# Altium project BLDC_MOTOR_DRIVER.PrjPcb (part 1 of 3)
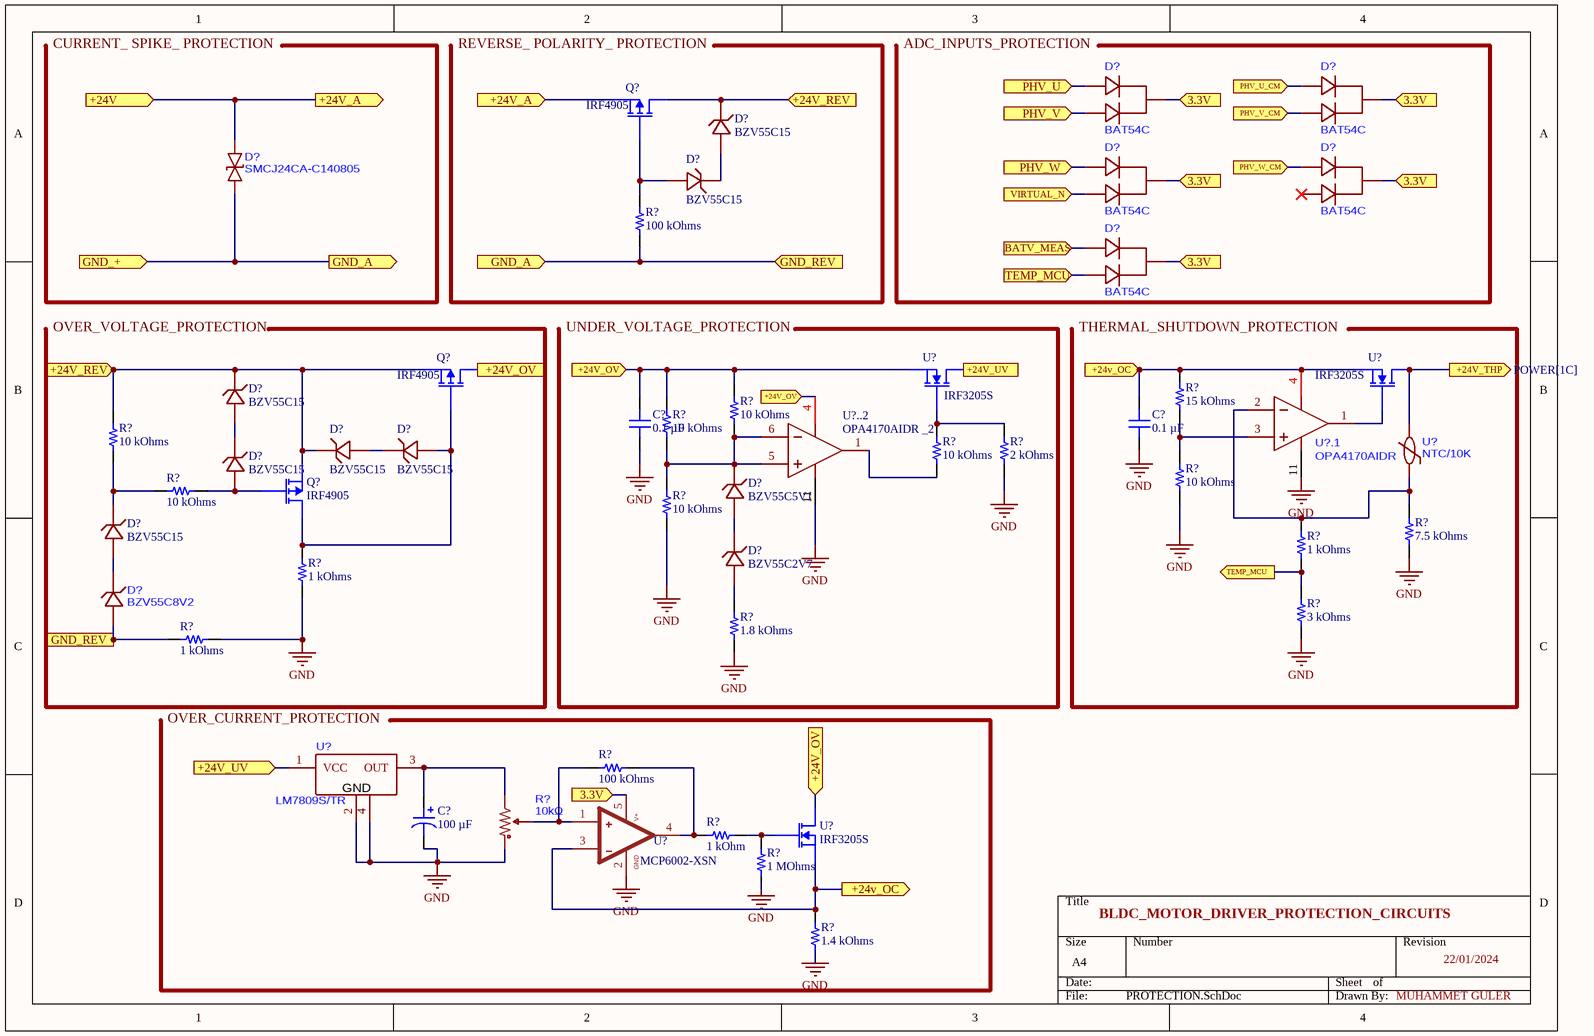
[diagram p0: PROTECTION.SchDoc]
4 sheets, 191 parts. Net scope: flat (ports and power ports of the same name join across sheets).
Board file: BLDC_PCB.PcbDoc
Sheets:
  PROTECTION.SchDoc
  DRIVER.SchDoc
  POWER.SchDoc
  MCU.SchDoc

## Sheet PROTECTION.SchDoc
size A4; SheetNumber: 1; SheetTotal: 4

### Parts
(Parts that share a designator on the sheet are numbered #1, #2 ... from top to bottom, then left to right.)
C?#1  0.1 µF  [CAP 1210_3225 - 1MM]
C?#2  0.1 µF  [CAP 1210_3225 - 1MM]
C?#3  100 µF  [CAP ALSMD POLY 5.3MM H5.7MM]
D?#1  BAT54C  [SOT-23-3_L2.9-W1.6-P1.90-LS2.8-BR]
D?#2  BAT54C  [SOT-23-3_L2.9-W1.6-P1.90-LS2.8-BR]
D?#3  BZV55C15  [SOD-80_L3.5-W1.5-RD]
D?#4  SMCJ24CA-C140805  [SMC_L6.9-W5.9-LS7.9-BI]
D?#5  BZV55C15  [SOD-80_L3.5-W1.5-RD]
D?#6  BAT54C  [SOT-23-3_L2.9-W1.6-P1.90-LS2.8-BR]
D?#7  BAT54C  [SOT-23-3_L2.9-W1.6-P1.90-LS2.8-BR]
D?#8  BAT54C  [SOT-23-3_L2.9-W1.6-P1.90-LS2.8-BR]
D?#9  BZV55C15  [SOD-80_L3.5-W1.5-RD]
D?#10  BZV55C15  [SOD-80_L3.5-W1.5-RD]
D?#11  BZV55C15  [SOD-80_L3.5-W1.5-RD]
D?#12  BZV55C15  [SOD-80_L3.5-W1.5-RD]
D?#13  BZV55C5V1  [SOD-80_L3.5-W1.5-RD]
D?#14  BZV55C15  [SOD-80_L3.5-W1.5-RD]
D?#15  BZV55C2V7  [SOD-80_L3.5-W1.5-RD]
D?#16  BZV55C8V2  [SOD-80_L3.5-W1.5-RD]
Q?#1  IRF4905  [IRF4905]
Q?#2  IRF4905  [IRF4905]
Q?#3  IRF4905  [IRF4905]
R?#1  100 kOhms  [RES 1210_3225]
R?#2  15 kOhms  [RES 1210_3225]
R?#3  10 kOhms  [RES 1210_3225]
R?#4  10 kOhms  [RES 1210_3225]
R?#5  10 kOhms  [RES 1210_3225]
R?#6  10 kOhms  [RES 1210_3225]
R?#7  2 kOhms  [RES 1210_3225]
R?#8  10 kOhms  [RES 1210_3225]
R?#9  10 kOhms  [RES 1210_3225]
R?#10  10 kOhms  [RES 1210_3225]
R?#11  7.5 kOhms  [RES 1210_3225]
R?#12  1 kOhms  [RES 1210_3225]
R?#13  1 kOhms  [RES 1210_3225]
R?#14  3 kOhms  [RES 1210_3225]
R?#15  1.8 kOhms  [RES 1210_3225]
R?#16  1 kOhms  [RES 1210_3225]
R?#17  100 kOhms  [RES 1210_3225]
R?#18  10kΩ
R?#19  1 kOhm  [RES 1210_3225]
R?#20  1 MOhms  [RES 1210_3225]
R?#21  1.4 kOhms  [RES 1210_3225]
U?#1  IRF3205S  [IRF4905]
U?#2  IRF3205S  [IRF4905]
U?#3  NTC/10K  [R1210]
U?#4  LM7809S/TR  [TO-263-3_LM7809]
U?#5  MCP6002-XSN  [MSOP-8_MCP6002-XSN]
U?#6  IRF3205S  [IRF4905]
U?.1  OPA4170AIDR  [SOIC-14_OPA4170]
U?..2  OPA4170AIDR _2  [SOIC-14_OPA4170]

### Ports
3.3V (in, see DRIVER[3A], DRIVER[4B], MCU[1B], MCU[1C], MCU[1D], MCU[2A], MCU[2B], MCU[2C], MCU[2D], MCU[3A], MCU[3B], MCU[3D], MCU[4A], MCU[4C], POWER[2A], POWER[3A], POWER[3B], POWER[4A], PROTECTION[2D], PROTECTION[4A]), 3.3V (in, see DRIVER[3A], DRIVER[4B], MCU[1B], MCU[1C], MCU[1D], MCU[2A], MCU[2B], MCU[2C], MCU[2D], MCU[3A], MCU[3B], MCU[3D], MCU[4A], MCU[4C], POWER[2A], POWER[3A], POWER[3B], POWER[4A], PROTECTION[2D], PROTECTION[4A], PROTECTION[4B]), 3.3V (in, see DRIVER[3A], DRIVER[4B], MCU[1B], MCU[1C], MCU[1D], MCU[2A], MCU[2B], MCU[2C], MCU[2D], MCU[3A], MCU[3B], MCU[3D], MCU[4A], MCU[4C], POWER[2A], POWER[3A], POWER[3B], POWER[4A], PROTECTION[4A], PROTECTION[4B]), +24V (in, see POWER[4C]), +24V_A (in, see PROTECTION[1A]), +24V_A (out, see PROTECTION[2A]), +24v_OC (in, see POWER[1C], POWER[2C], PROTECTION[3D]), +24v_OC (out, see POWER[1C], POWER[2C], PROTECTION[3B]), +24V_OV (in, see PROTECTION[2B]), +24V_OV (in, see PROTECTION[2B], PROTECTION[3D]), +24V_OV (out, see PROTECTION[2B], PROTECTION[3D]), +24V_REV (in, see PROTECTION[1B]), +24V_REV (in, see PROTECTION[3A]), +24V_THP (out, see POWER[1C]), +24V_UV (in, see PROTECTION[1C]), +24V_UV (in, see PROTECTION[3B]), BATV_MEAS (in), GND_+ (in), GND_A (in, see PROTECTION[1B]), GND_A (out, see PROTECTION[2B]), GND_REV (in, see PROTECTION[1C]), GND_REV (in, see PROTECTION[2B]), PHV_U (in, see DRIVER[2A], DRIVER[3B], MCU[2B]), PHV_U_CM (in, see MCU[2B], POWER[3A]), PHV_V (in, see DRIVER[3B], DRIVER[4A], MCU[2B]), PHV_V_CM (in, see MCU[2B], POWER[3B]), PHV_W (in, see DRIVER[3B], DRIVER[4B], MCU[2B]), PHV_W_CM (in, see MCU[2B], POWER[4A]), TEMP_MCU (in, see MCU[3B], PROTECTION[4C]), TEMP_MCU (out, see MCU[3B], PROTECTION[3B]), VIRTUAL_N (in, see DRIVER[2A], DRIVER[2B], DRIVER[4A], DRIVER[4B], MCU[2B])

### Nets
GND: C?#1.2 C?#2.2 C?#3.2 R?#7.2 R?#8.2 R?#10.2 R?#11.2 R?#13.2 R?#14.2 R?#15.2 R?#16.1 R?#18.2 R?#20.2 R?#21.2 U?#4.2(GND) U?#4.4(GND) U?#5.2(GND) U?.1.11(V-) U?..2.11(V-)
NetC?#1_1: C?#1.1 Q?#2.2(D) R?#3.1 R?#4.1 U?#1.3(S) U?#6.2(D) U?..2.4(V+) ; port +24V_OV
NetC?#2_1: C?#2.1 R?#2.1 R?#21.1 U?#2.3(S) U?#5.3(-) U?#6.3(S) U?.1.4(V+) ; port +24v_OC
NetC?#3_1: C?#3.1 R?#18.1 U?#4.3(OUT)
NetC?#4_1: D?#1.3(K) D?#2.3(K) D?#6.3(K) D?#7.3(K) D?#8.3(K) U?#5.5(V+) ; port 3.3V
NetC?#11_1: D?#6.2(A2) ; port VIRTUAL_N
NetD?#1_1: D?#1.1(A1) ; port PHV_U
NetD?#1_2: D?#1.2(A2) ; port PHV_V
NetD?#2_1: D?#2.1(A1) ; port PHV_U_CM
NetD?#2_2: D?#2.2(A2) ; port PHV_V_CM
NetD?#3_1: D?#3.1(C) D?#9.1(C) D?#10.1(C) Q?#1.2(D) Q?#2.3(S) Q?#3.3(S) R?#5.1 ; port +24V_REV
NetD?#3_2: D?#3.2(A) D?#5.1(C)
NetD?#4_1: D?#4.1 Q?#1.3(S) ; port +24V, port +24V_A
NetD?#4_2: D?#4.2 D?#16.2(A) R?#1.2 R?#16.2 ; port GND_+, port GND_A, port GND_REV
NetD?#5_2: D?#5.2(A) Q?#1.1(G) R?#1.1
NetD?#6_1: D?#6.1(A1) ; port PHV_W
NetD?#7_1: D?#7.1(A1) ; port PHV_W_CM
NetD?#8_1: D?#8.1(A1) ; port BATV_MEAS
NetD?#8_2: D?#8.2(A2) R?#12.2 R?#14.1 ; port TEMP_MCU
NetD?#9_2: D?#9.2(A) D?#12.1(C)
NetD?#10_2: D?#10.2(A) D?#11.1(C)
NetD?#11_2: D?#11.2(A) Q?#2.1(G) Q?#3.2(D) R?#13.1
NetD?#12_2: D?#12.2(A) Q?#3.1(G) R?#9.1
NetD?#13_1: D?#13.1(C) R?#3.2 R?#4.2 R?#10.1 U?..2.5(INB+) U?..2.6(INB-)
NetD?#13_2: D?#13.2(A) D?#15.1(C)
NetD?#14_1: D?#14.1(C) R?#5.2 R?#9.2
NetD?#14_2: D?#14.2(A) D?#16.1(C)
NetD?#15_2: D?#15.2(A) R?#15.1
NetR?#2_2: R?#2.2 R?#8.1 U?.1.3(INA+)
NetR?#6_1: R?#6.1 R?#7.1 U?#1.1(G)
NetR?#6_2: R?#6.2 U?..2.1(OUTA)
NetR?#11_1: R?#11.1 R?#12.1 U?#3.1 U?.1.2(INA-)
NetR?#17_1: R?#17.1 R?#18.3 U?#5.1(+)
NetR?#17_2: R?#17.2 R?#19.1 U?#5.4(OUT)
NetR?#19_2: R?#19.2 R?#20.1 U?#6.1(G)
NetR?#51_1: U?#2.2(D) U?#3.2 ; port +24V_THP
NetU?#1_2: U?#1.2(D) U?#4.1(VCC) ; port +24V_UV
NetU?#2_1: U?#2.1(G) U?.1.1(OUTA)

Not connected (* = marked no-connect by the designer): D?#7 2(A2)*

### Notes on the sheet
- CURRENT_ SPIKE_ PROTECTION
- (near Q?#1) REVERSE_ POLARITY_ PROTECTION
- ADC_INPUTS_PROTECTION
- OVER_VOLTAGE_PROTECTION
- UNDER_VOLTAGE_PROTECTION
- THERMAL_SHUTDOWN_PROTECTION
- (near U?#4) OVER_CURRENT_PROTECTION
- BLDC_MOTOR_DRIVER_PROTECTION_CIRCUITS
- 22/01/2024
- MUHAMMET GÜLER

### Library data of the parts
C?#1 C?#2 = CAN13X104KARAC7800: CAP CER 1210 0.1UF 250VAC X7R; manufacturer: KEMET; Tolerance: ±10%; Part Number: CAN13X104KARAC7800; Value: 0.1 µF; Applications: Boardflex Sensitive; Capacitance: 0.1 µF; componentlink1description: Datasheet; componentlink1url: //media.digikey.com/pdf/Data%20Sheets/Kemet%20PDFs/CAN13X104KARACTU_Spec.pdf; componentlink2description: DigiKey Link; componentlink2url: https://www.digikey.com/en/products/detail/kemet/CAN13X104KARAC7800/9962480; Device Package: 1210 (3225 Metric); Features: Soft Termination; lastupdated: 15.01.2024 20:41:47; Lifecycle Status: Active; Minimum Order: 1; Mounting Type: Surface Mount, MLCC; Operating Temperature: -55°C ~ 125°C; Package / Case: 1210 (3225 Metric); packaging: TapeAndReel; partid: 23615; Part Status: Active; price: 0.37; series: CAN SMD Indust X7R; Size / Dimension: 0.130" L x 0.102" W (3.30mm x 2.60mm); Supplier 1: DigiKey; Supplier Part Number 1: 399-20611-1-ND; Temperature Coefficient: X7R; Thickness (Max): 0.110" (2.80mm); Voltage - Rated: 250VAC
C?#3 = RFS0J101MCN1GS: CAP ALUM POLY 100UF 20% 6.3V SMD; manufacturer: Nichicon; ESR (Equivalent Series Resistance): 24mOhm; Lifetime @ Temp.: 2000 Hrs @ 105°C; Ripple Current @ High Frequency: 2.5 A @ 100 kHz; Ripple Current @ Low Frequency: 250 mA @ 120 Hz; Surface Mount Land Size: 0.209" L x 0.209" W (5.30mm x 5.30mm); Type: Polymer; Part Number: RFS0J101MCN1GS; Applications: General Purpose; Capacitance: 100 µF; componentlink1description: Datasheet; componentlink1url: http://nichicon-us.com/english/products/pdfs/e-rfs_rfa.pdf; componentlink2description: DigiKey Link; componentlink2url: https://www.digikey.com/en/products/detail/nichicon/RFS0J101MCN1GS/2202794; Device Package: Radial, Can - SMD; Height - Seated (Max): 0.224" (5.70mm); lastupdated: 13.01.2024 21:35:56; Lifecycle Status: Active; Minimum Order: 1; Mounting Type: Surface Mount; Operating Temperature: -55°C ~ 105°C; Package / Case: Radial, Can - SMD; packaging: TapeAndReel; partid: 1897; Part Status: Active; price: 0.25; series: FPCAP, RFS; Size / Dimension: 0.197" Dia (5.00mm); Supplier 1: DigiKey; Supplier Part Number 1: 493-3680-1-ND; Tolerance: ±20%; value: 100 µF; Voltage - Rated: 6.3 V
R?#1 R?#17 = RMCF1210FT100K: RES 100K OHM 1% 1/2W 1210; Manufacturer: Stackpole Electronics Inc; Power (Watts): 0.5W, 1/2W; Temperature Coefficient: ±100ppm/°C; Part Number: RMCF1210FT100K; ComponentLink1Description: Datasheet; ComponentLink1URL: https://www.seielect.com/catalog/sei-packaging.pdf; ComponentLink2Description: DigiKey Link; ComponentLink2URL: https://www.digikey.com/en/products/detail/stackpole-electronics-inc/RMCF1210FT100K/1758471; Composition: Thick Film; Device Package: 1210 (3225 Metric); Features: Automotive AEC-Q200; Height - Seated (Max): 0.028" (0.70mm); LastUpdated: 13.01.2024 21:51:14; Lifecycle Status: Active; Minimum Order: 1; Number of Terminations: 2; Operating Temperature: -55°C ~ 155°C; Package / Case: 1210 (3225 Metric); Packaging: TapeAndReel; Part Status: Active; Price: 0.01; Ratings: AEC-Q200; Resistance: 100 kOhms; Series: RMCF; Size / Dimension: 0.126" L x 0.098" W (3.20mm x 2.50mm); Supplier 1: DigiKey; Supplier Part Number 1: RMCF1210FT100KCT-ND; Supplier Device Package: 1210; Tolerance: ±1%; Value: 100 kOhms
R?#2 = CRCW121015K0FKEAHP: RES SMD 15K OHM 1% 3/4W 1210; Manufacturer: Vishay Dale; Power (Watts): 0.75W, 3/4W; Temperature Coefficient: ±100ppm/°C; Part Number: CRCW121015K0FKEAHP; ComponentLink1Description: Datasheet; ComponentLink1URL: http://www.vishay.com/docs/20043/crcwhpe3.pdf; ComponentLink2Description: DigiKey Link; ComponentLink2URL: https://www.digikey.com/en/products/detail/vishay-dale/CRCW121015K0FKEAHP/2567283; Composition: Thick Film; Device Package: 1210 (3225 Metric); Features: Automotive AEC-Q200, Pulse Withstanding; Height - Seated (Max): 0.028" (0.70mm); LastUpdated: 15.01.2024 21:47:36; Lifecycle Status: Active; Minimum Order: 1; Number of Terminations: 2; Operating Temperature: -55°C ~ 155°C; Package / Case: 1210 (3225 Metric); Packaging: TapeAndReel; Part Status: Active; Price: 0.13; Ratings: AEC-Q200; Resistance: 15 kOhms; Series: CRCW-HP; Size / Dimension: 0.126" L x 0.098" W (3.20mm x 2.50mm); Supplier 1: DigiKey; Supplier Part Number 1: 541-15.0KDCT-ND; Supplier Device Package: 1210; Tolerance: ±1%; Value: 15 kOhms
R?#3-R?#6 R?#8-R?#10 = RMCF1210FT10K0: RES 10K OHM 1% 1/2W 1210; Manufacturer: Stackpole Electronics Inc; Power (Watts): 0.5W, 1/2W; Temperature Coefficient: ±100ppm/°C; Part Number: RMCF1210FT10K0; ComponentLink1Description: Datasheet; ComponentLink1URL: https://www.seielect.com/catalog/sei-rmcf_rmcp.pdf; ComponentLink2Description: DigiKey Link; ComponentLink2URL: https://www.digikey.com/en/products/detail/stackpole-electronics-inc/RMCF1210FT10K0/1758528; Composition: Thick Film; Device Package: 1210 (3225 Metric); Features: Automotive AEC-Q200; Height - Seated (Max): 0.028" (0.70mm); Lifecycle Status: Active; Minimum Order: 1; Number of Terminations: 2; Operating Temperature: -55°C ~ 155°C; Package / Case: 1210 (3225 Metric); Packaging: TapeAndReel; Part Status: Active; Price: 0.01; Ratings: AEC-Q200; Resistance: 10 kOhms; Series: RMCF; Size / Dimension: 0.126" L x 0.098" W (3.20mm x 2.50mm); Supplier 1: DigiKey; Supplier Part Number 1: RMCF1210FT10K0CT-ND; Supplier Device Package: 1210; Tolerance: ±1%; Value: 10 kOhms
  R?#3 R?#4 R?#6 R?#10: LastUpdated: 16.01.2024 21:51:52
  R?#5 R?#9: LastUpdated: 13.01.2024 21:51:22
  R?#8: LastUpdated: 15.01.2024 21:47:42
R?#7 = RT1210BRD072KL: RES SMD 2K OHM 0.1% 1/4W 1210; Manufacturer: Yageo; Power (Watts): 0.25W, 1/4W; Temperature Coefficient: ±25ppm/°C; Part Number: RT1210BRD072KL; ComponentLink1Description: Datasheet; ComponentLink1URL: https://www.yageo.com/upload/media/product/productsearch/datasheet/rchip/PYu-RT_1-to-0.01_RoHS_L_11.pdf; ComponentLink2Description: DigiKey Link; ComponentLink2URL: https://www.digikey.com/en/products/detail/yageo/RT1210BRD072KL/5138742; Composition: Thin Film; Device Package: 1210 (3225 Metric); Height - Seated (Max): 0.026" (0.65mm); LastUpdated: 16.01.2024 21:51:50; Lifecycle Status: Active; Minimum Order: 1; Number of Terminations: 2; Operating Temperature: -55°C ~ 125°C; Package / Case: 1210 (3225 Metric); Packaging: TapeAndReel; Part Status: Active; Price: 0.20; Resistance: 2 kOhms; Series: RT; Size / Dimension: 0.122" L x 0.102" W (3.10mm x 2.60mm); Supplier 1: DigiKey; Supplier Part Number 1: YAG2223CT-ND; Supplier Device Package: 1210; Tolerance: ±0.1%; Value: 2 kOhms
R?#11 = ERJ-P14J752U: RES SMD 7.5K OHM 5% 1/2W 1210; Manufacturer: Panasonic Electronic Components; Power (Watts): 0.5W, 1/2W; Temperature Coefficient: ±200ppm/°C; Part Number: ERJ-P14J752U; ComponentLink1Description: Datasheet; ComponentLink1URL: https://industrial.panasonic.com/cdbs/www-data/pdf/RDO0000/AOA0000C331.pdf; ComponentLink2Description: DigiKey Link; ComponentLink2URL: https://www.digikey.com/en/products/detail/panasonic-electronic-components/ERJ-P14J752U/570476; Composition: Thick Film; Device Package: 1210 (3225 Metric); Features: Automotive AEC-Q200, Pulse Withstanding; Height - Seated (Max): 0.028" (0.70mm); LastUpdated: 15.01.2024 21:47:38; Lifecycle Status: Active; Minimum Order: 1; Number of Terminations: 2; Operating Temperature: -55°C ~ 155°C; Package / Case: 1210 (3225 Metric); Packaging: TapeAndReel; Part Status: Active; Price: 0.02; Ratings: AEC-Q200; Resistance: 7.5 kOhms; Series: ERJ-P14; Size / Dimension: 0.126" L x 0.098" W (3.20mm x 2.50mm); Supplier 1: DigiKey; Supplier Part Number 1: P7.5KASCT-ND; Supplier Device Package: 1210; Tolerance: ±5%; Value: 7.5 kOhms
R?#12 = RC1210JR-071KL: RES 1K OHM 5% 1/2W 1210; Manufacturer: Yageo; Power (Watts): 0.5W, 1/2W; Temperature Coefficient: ±100ppm/°C; Part Number: RC1210JR-071KL; ComponentLink1Description: Datasheet; ComponentLink1URL: https://www.yageo.com/upload/media/product/productsearch/datasheet/rchip/PYu-RC_Group_51_RoHS_L_10.pdf; ComponentLink2Description: DigiKey Link; ComponentLink2URL: https://www.digikey.com/en/products/detail/yageo/RC1210JR-071KL/5919874; Composition: Thick Film; Device Package: 1210 (3225 Metric); Features: Moisture Resistant; Height - Seated (Max): 0.024" (0.60mm); LastUpdated: 15.01.2024 21:47:42; Lifecycle Status: Active; Minimum Order: 1; Number of Terminations: 2; Operating Temperature: -55°C ~ 155°C; Package / Case: 1210 (3225 Metric); Packaging: TapeAndReel; Part Status: Active; Price: 0.01; Resistance: 1 kOhms; Series: RC_L; Size / Dimension: 0.122" L x 0.102" W (3.10mm x 2.60mm); Supplier 1: DigiKey; Supplier Part Number 1: YAG3377CT-ND; Supplier Device Package: 1210; Tolerance: ±5%; Value: 1 kOhms
R?#13 = CRCW12101K00FKTA: RES SMD 1K OHM 1% 1/2W 1210; Manufacturer: Vishay Dale; Power (Watts): 0.5W, 1/2W; Temperature Coefficient: ±100ppm/°C; Part Number: CRCW12101K00FKTA; ComponentLink1Description: Datasheet; ComponentLink1URL: http://www.vishay.com/docs/20008/dcrcw.pdf; ComponentLink2Description: DigiKey Link; ComponentLink2URL: https://www.digikey.com/en/products/detail/vishay-dale/CRCW12101K00FKTA/1224396; Composition: Thick Film; Device Package: 1210 (3225 Metric); Features: Automotive AEC-Q200; Height - Seated (Max): 0.024" (0.60mm); LastUpdated: 15.01.2024 21:47:34; Lifecycle Status: Active; Minimum Order: 1; Number of Terminations: 2; Operating Temperature: -55°C ~ 155°C; Package / Case: 1210 (3225 Metric); Packaging: TapeAndReel; Part Status: Active; Price: 0.05; Ratings: AEC-Q200; Resistance: 1 kOhms; Series: CRCW; Size / Dimension: 0.126" L x 0.098" W (3.20mm x 2.50mm); Supplier 1: DigiKey; Supplier Part Number 1: 541-CRCW12101K00FKTACT-ND; Supplier Device Package: 1210; Tolerance: ±1%; Value: 1 kOhms
R?#14 = RC1210FR-073KL: RES 3K OHM 1% 1/2W 1210; Manufacturer: Yageo; Power (Watts): 0.5W, 1/2W; Temperature Coefficient: ±100ppm/°C; Part Number: RC1210FR-073KL; ComponentLink2Description: DigiKey Link; ComponentLink2URL: https://www.digikey.com/en/products/detail/yageo/RC1210FR-073KL/5919566; Composition: Thick Film; Device Package: 1210 (3225 Metric); Features: Moisture Resistant; Height - Seated (Max): 0.024" (0.60mm); LastUpdated: 15.01.2024 21:47:33; Lifecycle Status: Active; Minimum Order: 1; Number of Terminations: 2; Operating Temperature: -55°C ~ 155°C; Package / Case: 1210 (3225 Metric); Packaging: TapeAndReel; Part Status: Active; Price: 0.01; Resistance: 3 kOhms; Series: RC_L; Size / Dimension: 0.122" L x 0.102" W (3.10mm x 2.60mm); Supplier 1: DigiKey; Supplier Part Number 1: 13-RC1210FR-073KLCT-ND; Supplier Device Package: 1210; Tolerance: ±1%; Value: 3 kOhms
R?#15 = RK73B2ETTD182J: RES 1.8K OHM 5% 1/2W 1210; Manufacturer: KOA Speer Electronics, Inc.; Power (Watts): 0.5W, 1/2W; Temperature Coefficient: ±200ppm/°C; Part Number: RK73B2ETTD182J; ComponentLink1Description: Datasheet; ComponentLink1URL: http://www.koaspeer.com/catimages/Products/RK73B/RK73B.pdf; ComponentLink2Description: DigiKey Link; ComponentLink2URL: https://www.digikey.com/en/products/detail/koa-speer-electronics-inc/RK73B2ETTD182J/10314973; Composition: Thick Film; Device Package: 1210 (3225 Metric); Features: Automotive AEC-Q200; Height - Seated (Max): 0.028" (0.70mm); LastUpdated: 16.01.2024 21:51:44; Lifecycle Status: Active; Minimum Order: 1; Number of Terminations: 2; Operating Temperature: -55°C ~ 155°C; Package / Case: 1210 (3225 Metric); Packaging: TapeAndReel; Part Status: Active; Price: 0.01; Ratings: AEC-Q200; Resistance: 1.8 kOhms; Series: RK73B; Size / Dimension: 0.126" L x 0.102" W (3.20mm x 2.60mm); Supplier 1: DigiKey; Supplier Part Number 1: 2019-RK73B2ETTD182JCT-ND; Supplier Device Package: 1210; Tolerance: ±5%; Value: 1.8 kOhms
R?#16 = RMCF1210FT100K: RES 100K OHM 1% 1/2W 1210; Manufacturer: Stackpole Electronics Inc; Power (Watts): 0.5W, 1/2W; Resistance: 100 kOhms; Temperature Coefficient: ±100ppm/°C; Value: 100 kOhms; Part Number: RMCF1210FT100K; ComponentLink1Description: Datasheet; ComponentLink1URL: https://www.seielect.com/catalog/sei-packaging.pdf; ComponentLink2Description: DigiKey Link; ComponentLink2URL: https://www.digikey.com/en/products/detail/stackpole-electronics-inc/RMCF1210FT100K/1758471; Composition: Thick Film; Device Package: 1210 (3225 Metric); Features: Automotive AEC-Q200; Height - Seated (Max): 0.028" (0.70mm); LastUpdated: 13.01.2024 21:51:14; Lifecycle Status: Active; Minimum Order: 1; Number of Terminations: 2; Operating Temperature: -55°C ~ 155°C; Package / Case: 1210 (3225 Metric); Packaging: TapeAndReel; Part Status: Active; Price: 0.01; Ratings: AEC-Q200; Series: RMCF; Size / Dimension: 0.126" L x 0.098" W (3.20mm x 2.50mm); Supplier 1: DigiKey; Supplier Part Number 1: RMCF1210FT100KCT-ND; Supplier Device Package: 1210; Tolerance: ±1%
R?#18 = PS10KV50-103A3030
R?#19 = RMCF1210FT1K40: RES 1.4K OHM 1% 1/2W 1210; Manufacturer: Stackpole Electronics Inc; Power (Watts): 0.5W, 1/2W; Resistance: 1.4 kOhms; Temperature Coefficient: ±100ppm/°C; Value: 1.4 kOhms; Part Number: RMCF1210FT1K40; ComponentLink1Description: Datasheet; ComponentLink1URL: https://www.seielect.com/catalog/sei-rmcf_rmcp.pdf; ComponentLink2Description: DigiKey Link; ComponentLink2URL: https://www.digikey.com/en/products/detail/stackpole-electronics-inc/RMCF1210FT1K40/1715350; Composition: Thick Film; Device Package: 1210 (3225 Metric); Features: Automotive AEC-Q200; Height - Seated (Max): 0.028" (0.70mm); LastUpdated: 13.01.2024 21:51:14; Lifecycle Status: Active; Minimum Order: 1; Number of Terminations: 2; Operating Temperature: -55°C ~ 155°C; Package / Case: 1210 (3225 Metric); Packaging: TapeAndReel; Part Status: Active; Price: 0.01; Ratings: AEC-Q200; Series: RMCF; Size / Dimension: 0.126" L x 0.098" W (3.20mm x 2.50mm); Supplier 1: DigiKey; Supplier Part Number 1: 738-RMCF1210FT1K40CT-ND; Supplier Device Package: 1210; Tolerance: ±1%
R?#20 = TNPV12101M00DEEA: RES SMD 1M OHM 0.5% 1/3W 1210; Manufacturer: Vishay Dale; Power (Watts): 0.333W, 1/3W; Temperature Coefficient: ±25ppm/°C; Part Number: TNPV12101M00DEEA; ComponentLink1Description: Datasheet; ComponentLink1URL: http://www.vishay.com/docs/28881/tnpve3.pdf; ComponentLink2Description: DigiKey Link; ComponentLink2URL: https://www.digikey.com/en/products/detail/vishay-dale/TNPV12101M00DEEA/6570120; Composition: Thin Film; Device Package: 1210 (3225 Metric); Features: Anti-Sulfur, Automotive AEC-Q200, High Voltage, Moisture Resistant; Height - Seated (Max): 0.030" (0.75mm); LastUpdated: 13.01.2024 21:51:15; Lifecycle Status: Active; Minimum Order: 1; Number of Terminations: 2; Operating Temperature: -55°C ~ 125°C; Package / Case: 1210 (3225 Metric); Packaging: TapeAndReel; Part Status: Active; Price: 0.46; Ratings: AEC-Q200; Resistance: 1 MOhms; Series: TNPV; Size / Dimension: 0.126" L x 0.096" W (3.20mm x 2.45mm); Supplier 1: DigiKey; Supplier Part Number 1: 541-3267-1-ND; Supplier Device Package: 1210; Tolerance: ±0.5%; Value: 1 MOhms
R?#21 = RMCF1210FT1K40: RES 1.4K OHM 1% 1/2W 1210; Manufacturer: Stackpole Electronics Inc; Power (Watts): 0.5W, 1/2W; Temperature Coefficient: ±100ppm/°C; Part Number: RMCF1210FT1K40; ComponentLink1Description: Datasheet; ComponentLink1URL: https://www.seielect.com/catalog/sei-rmcf_rmcp.pdf; ComponentLink2Description: DigiKey Link; ComponentLink2URL: https://www.digikey.com/en/products/detail/stackpole-electronics-inc/RMCF1210FT1K40/1715350; Composition: Thick Film; Device Package: 1210 (3225 Metric); Features: Automotive AEC-Q200; Height - Seated (Max): 0.028" (0.70mm); LastUpdated: 13.01.2024 21:51:14; Lifecycle Status: Active; Minimum Order: 1; Number of Terminations: 2; Operating Temperature: -55°C ~ 155°C; Package / Case: 1210 (3225 Metric); Packaging: TapeAndReel; Part Status: Active; Price: 0.01; Ratings: AEC-Q200; Resistance: 1.4 kOhms; Series: RMCF; Size / Dimension: 0.126" L x 0.098" W (3.20mm x 2.50mm); Supplier 1: DigiKey; Supplier Part Number 1: 738-RMCF1210FT1K40CT-ND; Supplier Device Package: 1210; Tolerance: ±1%; Value: 1.4 kOhms

## Sheet DRIVER.SchDoc
size A4; SheetNumber: 2; SheetTotal: 4
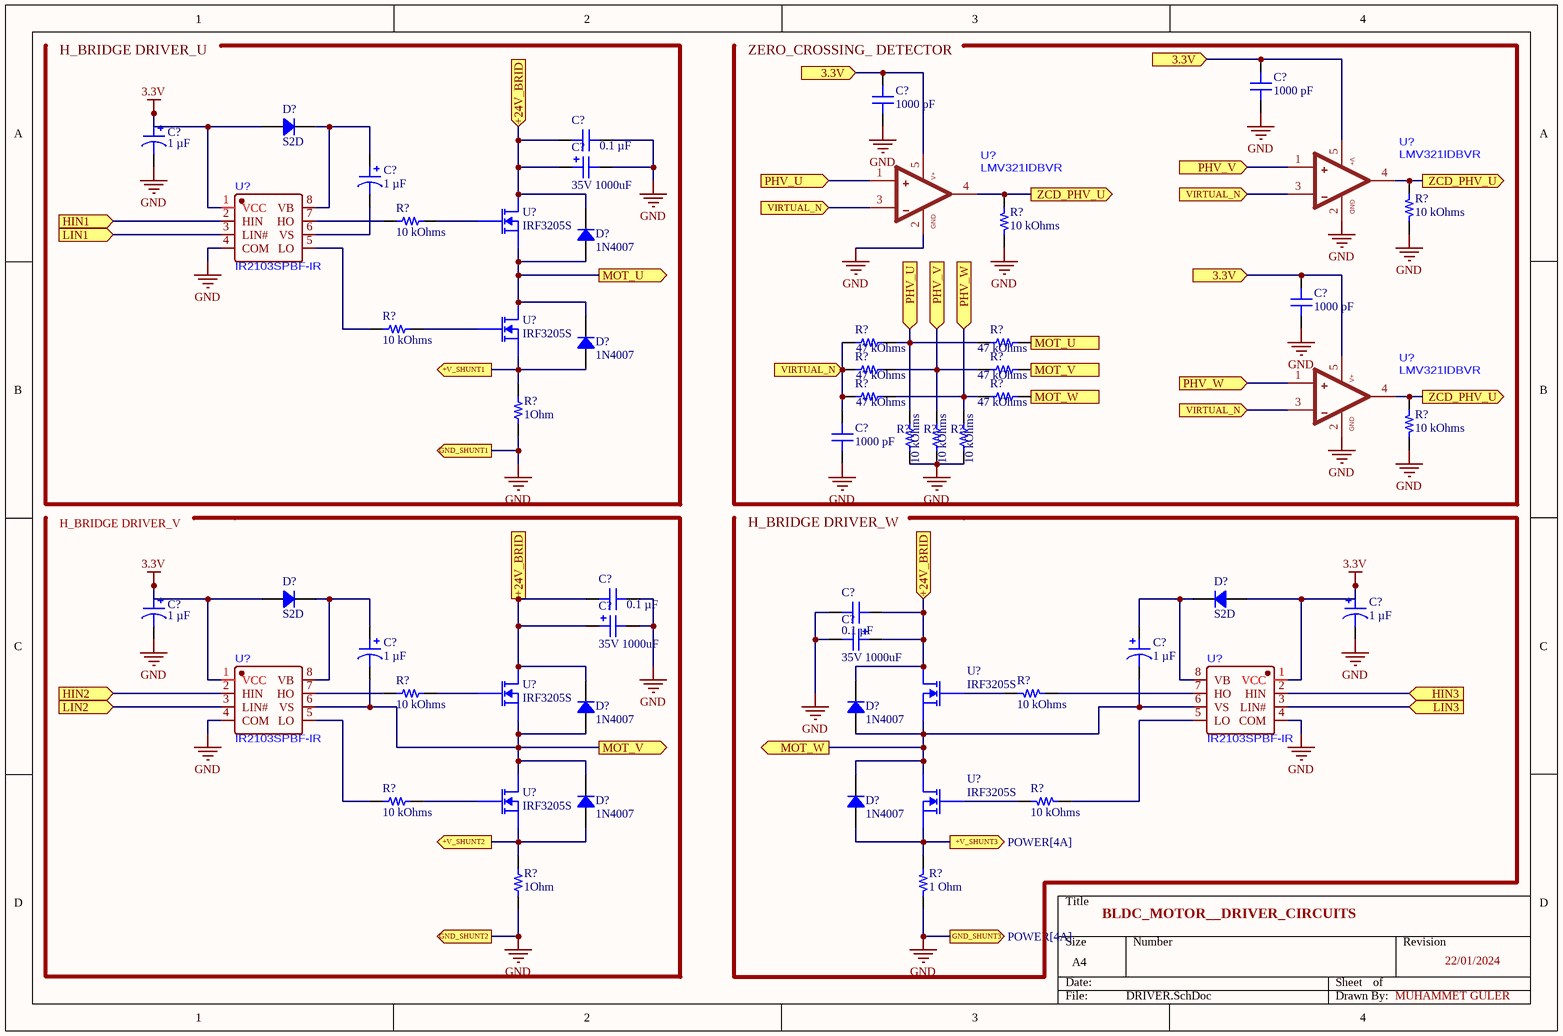
[diagram p1: DRIVER.SchDoc]

### Parts
(Parts that share a designator on the sheet are numbered #1, #2 ... from top to bottom, then left to right.)
C?#4  1000 pF  [CAP 1210_3225 - 1MM]
C?#5  1000 pF  [CAP 1210_3225 - 1MM]
C?#6  1 µF  [CAP ALSMD 4.3MM H5.4MM]
C?#7  0.1 µF  [CAP 1210_3225 - 1MM]
C?#8  35V 1000uF  [35V 1000uF]
C?#9  1 µF  [CAP ALSMD 4.3MM H5.4MM]
C?#10  1000 pF  [CAP 1210_3225 - 1MM]
C?#11  1000 pF  [CAP 1210_3225 - 1MM]
C?#12  0.1 µF  [CAP 1210_3225 - 1MM]
C?#13  1 µF  [CAP ALSMD 4.3MM H5.4MM]
C?#14  0.1 µF  [CAP 1210_3225 - 1MM]
C?#15  1 µF  [CAP ALSMD 4.3MM H5.4MM]
C?#16  35V 1000uF  [35V 1000uF]
C?#17  35V 1000uF  [35V 1000uF]
C?#18  1 µF  [CAP ALSMD 4.3MM H5.4MM]
C?#19  1 µF  [CAP ALSMD 4.3MM H5.4MM]
D?#17  S2D  [DO214AA SMB]
D?#18  1N4007  [DO214AA SMB]
D?#19  1N4007  [DO214AA SMB]
D?#20  S2D  [DO214AA SMB]
D?#21  S2D  [DO214AA SMB]
D?#22  1N4007  [DO214AA SMB]
D?#23  1N4007  [DO214AA SMB]
D?#24  1N4007  [DO214AA SMB]
D?#25  1N4007  [DO214AA SMB]
R?#22  10 kOhms  [RES 1210_3225]
R?#23  10 kOhms  [RES 1210_3225]
R?#24  10 kOhms  [RES 1210_3225]
R?#25  10 kOhms  [RES 1210_3225]
R?#26  47 kOhms  [RES 1210_3225]
R?#27  47 kOhms  [RES 1210_3225]
R?#28  47 kOhms  [RES 1210_3225]
R?#29  47 kOhms  [RES 1210_3225]
R?#30  47 kOhms  [RES 1210_3225]
R?#31  47 kOhms  [RES 1210_3225]
R?#32  1Ohm  [RES 1210_3225]
R?#33  10 kOhms  [RES 1210_3225]
R?#34  10 kOhms  [RES 1210_3225]
R?#35  10 kOhms  [RES 1210_3225]
R?#36  10 kOhms  [RES 1210_3225]
R?#37  10 kOhms  [RES 1210_3225]
R?#38  10 kOhms  [RES 1210_3225]
R?#39  10 kOhms  [RES 1210_3225]
R?#40  10 kOhms  [RES 1210_3225]
R?#41  1Ohm  [RES 1210_3225]
R?#42  1 Ohm  [RES 1210_3225]
U?#7  LMV321IDBVR  [SOT-23-5_LMV324ID]
U?#8  LMV321IDBVR  [SOT-23-5_LMV324ID]
U?#9  IRF3205S  [IRF4905]
U?#10  IR2103SPBF-IR  [SOIC-8_IR2103]
U?#11  IRF3205S  [IRF4905]
U?#12  LMV321IDBVR  [SOT-23-5_LMV324ID]
U?#13  IRF3205S  [IRF4905]
U?#14  IRF3205S  [IRF4905]
U?#15  IR2103SPBF-IR  [SOIC-8_IR2103]
U?#16  IR2103SPBF-IR  [SOIC-8_IR2103]
U?#17  IRF3205S  [IRF4905]
U?#18  IRF3205S  [IRF4905]

### Ports
3.3V (in, see DRIVER[3A], DRIVER[4B], MCU[1B], MCU[1C], MCU[1D], MCU[2A], MCU[2B], MCU[2C], MCU[2D], MCU[3A], MCU[3B], MCU[3D], MCU[4A], MCU[4C], POWER[2A], POWER[3A], POWER[3B], POWER[4A], PROTECTION[2D], PROTECTION[4A], PROTECTION[4B]), 3.3V (in, see DRIVER[3A], MCU[1B], MCU[1C], MCU[1D], MCU[2A], MCU[2B], MCU[2C], MCU[2D], MCU[3A], MCU[3B], MCU[3D], MCU[4A], MCU[4C], POWER[2A], POWER[3A], POWER[3B], POWER[4A], PROTECTION[2D], PROTECTION[4A], PROTECTION[4B]), +24V_BRID (in, see DRIVER[2A], DRIVER[2C], POWER[1A], POWER[1C], POWER[3C], POWER[4C]), +24V_BRID (in, see DRIVER[2A], DRIVER[3C], POWER[1A], POWER[1C], POWER[3C], POWER[4C]), +24V_BRID (in, see DRIVER[2C], DRIVER[3C], POWER[1A], POWER[1C], POWER[3C], POWER[4C]), +V_SHUNT1 (out, see POWER[3A]), +V_SHUNT2 (out, see POWER[3B]), +V_SHUNT3 (out, see POWER[4A]), GND_SHUNT1 (out, see POWER[3A]), GND_SHUNT2 (out, see POWER[3B]), GND_SHUNT3 (out, see POWER[4A]), HIN1 (in, see MCU[3B]), HIN2 (in, see MCU[3B]), HIN3 (in, see MCU[3B]), LIN1 (in, see MCU[3B]), LIN2 (in, see MCU[3A]), LIN3 (in, see MCU[3A]), MOT_U (in, see DRIVER[2B]), MOT_U (out, see DRIVER[3B]), MOT_V (in, see DRIVER[2C]), MOT_V (out, see DRIVER[3B]), MOT_W (in, see DRIVER[2C]), MOT_W (out, see DRIVER[3B]), PHV_U (in, see DRIVER[2A], MCU[2B], PROTECTION[3A]), PHV_U (in, see DRIVER[3B], MCU[2B], PROTECTION[3A]), PHV_V (in, see DRIVER[3B], MCU[2B], PROTECTION[3A]), PHV_V (in, see DRIVER[4A], MCU[2B], PROTECTION[3A]), PHV_W (in, see DRIVER[3B], MCU[2B], PROTECTION[3A]), PHV_W (in, see DRIVER[4B], MCU[2B], PROTECTION[3A]), VIRTUAL_N (in, see DRIVER[2A], DRIVER[2B], DRIVER[4A], MCU[2B], PROTECTION[3A]), VIRTUAL_N (in, see DRIVER[2A], DRIVER[2B], DRIVER[4B], MCU[2B], PROTECTION[3A]), VIRTUAL_N (in, see DRIVER[2A], DRIVER[4A], DRIVER[4B], MCU[2B], PROTECTION[3A]), VIRTUAL_N (in, see DRIVER[2B], DRIVER[4A], DRIVER[4B], MCU[2B], PROTECTION[3A]), ZCD_PHV_U (out, see DRIVER[3A], DRIVER[4A], MCU[2B]), ZCD_PHV_U (out, see DRIVER[3A], DRIVER[4B], MCU[2B]), ZCD_PHV_U (out, see DRIVER[4A], DRIVER[4B], MCU[2B])

### Nets
3.3V: C?#6.1 C?#13.1 C?#15.1 D?#17.1 D?#20.1 D?#21.1 U?#10.1(VCC) U?#15.1(VCC) U?#16.1(VCC)
GND: C?#4.2 C?#5.2 C?#6.2 C?#7.2 C?#8.2(out) C?#10.2 C?#11.2 C?#12.2 C?#13.2 C?#14.2 C?#15.2 C?#16.2(out) C?#17.2(out) R?#22.2 R?#24.2 R?#32.2 R?#33.2 R?#34.2 R?#35.2 R?#36.2 R?#41.2 R?#42.2 U?#7.2(GND) U?#8.2(GND) U?#10.4(COM) U?#12.2(GND) U?#15.4(COM) U?#16.4(COM) ; port GND_SHUNT1, port GND_SHUNT2, port GND_SHUNT3
NetC?#4_1: C?#4.1 C?#5.1 C?#10.1 U?#7.5(V+) U?#8.5(V+) U?#12.5(V+) ; port 3.3V
NetC?#7_1: C?#7.1 C?#8.1(in) C?#12.1 C?#14.1 C?#16.1(in) C?#17.1(in) D?#18.2 D?#22.2 D?#23.2 U?#9.2(D) U?#13.2(D) U?#14.2(D) ; port +24V_BRID
NetC?#9_1: C?#9.1 D?#17.2 U?#10.8(VB)
NetC?#9_2: C?#9.2 U?#10.6(VS)
NetC?#11_1: C?#11.1 R?#26.1 R?#28.1 R?#30.1 U?#7.3(-) U?#8.3(-) U?#12.3(-) ; port VIRTUAL_N
NetC?#18_1: C?#18.1 D?#20.2 U?#15.8(VB)
NetC?#18_2: C?#18.2 D?#22.1 D?#24.2 R?#29.2 U?#13.3(S) U?#15.6(VS) U?#17.2(D) ; port MOT_V
NetC?#19_1: C?#19.1 D?#21.2 U?#16.8(VB)
NetC?#19_2: C?#19.2 D?#23.1 D?#25.2 R?#31.2 U?#14.3(S) U?#16.6(VS) U?#18.2(D) ; port MOT_W
NetD?#1_1: R?#26.2 R?#27.1 R?#34.1 U?#8.1(+) ; port PHV_U
NetD?#1_2: R?#28.2 R?#29.1 R?#35.1 U?#7.1(+) ; port PHV_V
NetD?#6_1: R?#30.2 R?#31.1 R?#36.1 U?#12.1(+) ; port PHV_W
NetD?#18_1: D?#18.1 D?#19.2 R?#27.2 U?#9.3(S) U?#11.2(D) ; port MOT_U
NetD?#19_1: D?#19.1 R?#32.1 U?#11.3(S) ; port +V_SHUNT1
NetD?#24_1: D?#24.1 R?#41.1 U?#17.3(S) ; port +V_SHUNT2
NetD?#25_1: D?#25.1 R?#42.1 U?#18.3(S) ; port +V_SHUNT3
NetR?#22_1: R?#22.1 R?#24.1 R?#33.1 U?#7.4(OUT) U?#8.4(OUT) U?#12.4(OUT) ; port ZCD_PHV_U
NetR?#23_1: R?#23.1 U?#10.7(HO)
NetR?#23_2: R?#23.2 U?#9.1(G)
NetR?#25_1: R?#25.1 U?#10.5(LO)
NetR?#25_2: R?#25.2 U?#11.1(G)
NetR?#37_1: R?#37.1 U?#15.7(HO)
NetR?#37_2: R?#37.2 U?#13.1(G)
NetR?#38_1: R?#38.1 U?#16.7(HO)
NetR?#38_2: R?#38.2 U?#14.1(G)
NetR?#39_1: R?#39.1 U?#15.5(LO)
NetR?#39_2: R?#39.2 U?#17.1(G)
NetR?#40_1: R?#40.1 U?#16.5(LO)
NetR?#40_2: R?#40.2 U?#18.1(G)
NetU?#10_2: U?#10.2(HIN) ; port HIN1
NetU?#10_3: U?#10.3(LIN#) ; port LIN1
NetU?#15_2: U?#15.2(HIN) ; port HIN2
NetU?#15_3: U?#15.3(LIN#) ; port LIN2
NetU?#16_2: U?#16.2(HIN) ; port HIN3
NetU?#16_3: U?#16.3(LIN#) ; port LIN3

### Notes on the sheet
- H_BRIDGE DRIVER_U
- (near C?#5) ZERO_CROSSING_ DETECTOR
- H_BRIDGE DRIVER_V
- H_BRIDGE DRIVER_W
- BLDC_MOTOR__DRIVER_CIRCUITS
- 22/01/2024
- MUHAMMET GÜLER

### Library data of the parts
C?#4 C?#5 C?#10 C?#11 = C1210C102FDGACAUTO: CAP CER 1210 1NF 1000V C0G 1%; manufacturer: KEMET; Temperature Coefficient: C0G, NP0; Voltage - Rated: 1000V (1kV); Part Number: C1210C102FDGACAUTO; Value: 1000 pF; Applications: Automotive; Capacitance: 1000 pF; componentlink1description: Datasheet; componentlink1url: https://api.kemet.com/component-edge/download/datasheet/C1210C102FDGACAUTO.pdf; componentlink2description: DigiKey Link; componentlink2url: https://www.digikey.com/en/products/detail/kemet/C1210C102FDGACAUTO/8109920; Device Package: 1210 (3225 Metric); Features: Low ESL, High Voltage; lastupdated: 17.01.2024 20:42:51; Lifecycle Status: Active; Minimum Order: 1; Mounting Type: Surface Mount, MLCC; Operating Temperature: -55°C ~ 125°C; Package / Case: 1210 (3225 Metric); packaging: TapeAndReel; partid: 26118; Part Status: Active; price: 0.74; Ratings: AEC-Q200; series: SMD Auto C0G HV; Size / Dimension: 0.126" L x 0.098" W (3.20mm x 2.50mm); Supplier 1: DigiKey; Supplier Part Number 1: 399-16739-1-ND; Thickness (Max): 0.075" (1.90mm); Tolerance: ±1%
C?#6 C?#9 C?#13 C?#15 C?#18 C?#19 = EEE-1HA010NR: CAP ALUM 1UF 20% 50V SMD; manufacturer: Panasonic Electronic Components; Lifetime @ Temp.: 2000 Hrs @ 85°C; Polarization: Bi-Polar; Ripple Current @ High Frequency: 17 mA @ 10 kHz; Ripple Current @ Low Frequency: 10 mA @ 120 Hz; Surface Mount Land Size: 0.169" L x 0.169" W (4.30mm x 4.30mm); Part Number: EEE-1HA010NR; Applications: Automotive; Capacitance: 1 µF; componentlink1description: Datasheet; componentlink1url: //media.digikey.com/pdf/Data%20Sheets/Panasonic%20Electronic%20Components/S_Series,Type_V_Rev2018.pdf; componentlink2description: DigiKey Link; componentlink2url: https://www.digikey.com/en/products/detail/panasonic-electronic-components/EEE-1HA010NR/946216; Device Package: Radial, Can - SMD; Height - Seated (Max): 0.213" (5.40mm); lastupdated: 14.01.2024 21:24:17; Lifecycle Status: Active; Minimum Order: 1; Mounting Type: Surface Mount; Operating Temperature: -40°C ~ 85°C; Package / Case: Radial, Can - SMD; packaging: TapeAndReel; partid: 7035; Part Status: Active; price: 0.07; Ratings: AEC-Q200; series: S; Size / Dimension: 0.157" Dia (4.00mm); Supplier 1: DigiKey; Supplier Part Number 1: PCE4301CT-ND; Tolerance: ±20%; value: 1 µF; Voltage - Rated: 50 V
C?#7 C?#12 C?#14 = CAN13X104KARAC7800: as C?#1 on sheet PROTECTION; Part Number: CAN13X104KARAC7800; Value: 0.1 µF; Applications: Boardflex Sensitive; Capacitance: 0.1 µF; componentlink1description: Datasheet; componentlink1url: //media.digikey.com/pdf/Data%20Sheets/Kemet%20PDFs/CAN13X104KARACTU_Spec.pdf; componentlink2description: DigiKey Link; componentlink2url: https://www.digikey.com/en/products/detail/kemet/CAN13X104KARAC7800/9962480; Device Package: 1210 (3225 Metric); Features: Soft Termination; lastupdated: 14.01.2024 20:41:00; Lifecycle Status: Active; Minimum Order: 1; Mounting Type: Surface Mount, MLCC; Operating Temperature: -55°C ~ 125°C; Package / Case: 1210 (3225 Metric); packaging: TapeAndReel; partid: 23615; Part Status: Active; price: 0.37; series: CAN SMD Indust X7R; Size / Dimension: 0.130" L x 0.102" W (3.30mm x 2.60mm); Supplier 1: DigiKey; Supplier Part Number 1: 399-20611-1-ND; Temperature Coefficient: X7R; Thickness (Max): 0.110" (2.80mm); Voltage - Rated: 250VAC
D?#17 D?#20 D?#21 = S2D: DIODE GEN PURP 200V 2A SMB; Manufacturer: ON Semiconductor; Capacitance @ Vr, F: 30pF @ 4V, 1MHz; Current - Reverse Leakage @ Vr: 1µA @ 200V; Diode Type: Standard; Reverse Recovery Time (trr): 2µs; Speed: Standard Recovery >500ns, > 200mA (Io); Voltage - Forward (Vf) (Max) @ If: 1.15V @ 2A; Part Number: S2D; ComponentLink1Description: Datasheet; ComponentLink1URL: https://www.onsemi.com/pub/Collateral/S2M-D.pdf; ComponentLink2Description: DigiKey Link; ComponentLink2URL: http://digikey.com/product-detail/en/on-semiconductor/S2D/S2DFSCT-ND/4744685; Current - Average Rectified (Io): 2A; LastUpdated: 14.01.2024 21:25:24; Lifecycle Status: Active; Minimum Order: 1; Mounting Type: Surface Mount; Operating Temperature - Junction: -65°C ~ 150°C; Package / Case: DO-214AA, SMB; Packaging: TapeAndReel; PartId: 25; Part Status: Active; Price: 0.08; Series: -; Supplier 1: DigiKey; Supplier Part Number 1: S2DFSCT-ND; Supplier Device Package: SMB (DO-214AA); Voltage - DC Reverse (Vr) (Max): 200V
D?#18 D?#19 D?#22-D?#25 = RS1AB-13-F: DIODE GEN PURP 50V 1A SMB; Manufacturer: Diodes Incorporated; Capacitance @ Vr, F: 15pF @ 4V, 1MHz; Current - Reverse Leakage @ Vr: 5 µA @ 50 V; Diode Type: Standard; Reverse Recovery Time (trr): 150 ns; Speed: Fast Recovery =< 500ns, > 200mA (Io); Voltage - Forward (Vf) (Max) @ If: 1.3 V @ 1 A; Part Number: RS1AB-13-F; ComponentLink1Description: Datasheet; ComponentLink1URL: https://www.diodes.com/assets/Datasheets/ds15002.pdf; ComponentLink2Description: DigiKey Link; ComponentLink2URL: https://www.digikey.com/en/products/detail/diodes-incorporated/RS1AB-13-F/814456; Current - Average Rectified (Io): 1A; LastUpdated: 15.01.2024 21:24:42; Lifecycle Status: Active; Minimum Order: 1; Mounting Type: Surface Mount; Operating Temperature - Junction: -65°C ~ 150°C; Package / Case: DO-214AA, SMB; Packaging: TapeAndReel; PartId: 27; Part Status: Active; Price: 0.06; Series: -; Supplier 1: DigiKey; Supplier Part Number 1: RS1AB-FDICT-ND; Supplier Device Package: SMB; Voltage - DC Reverse (Vr) (Max): 50 V
R?#22-R?#25 R?#33-R?#40 = RMCF1210FT10K0: as R?#3 on sheet PROTECTION; Part Number: RMCF1210FT10K0; ComponentLink1Description: Datasheet; ComponentLink1URL: https://www.seielect.com/catalog/sei-rmcf_rmcp.pdf; ComponentLink2Description: DigiKey Link; ComponentLink2URL: https://www.digikey.com/en/products/detail/stackpole-electronics-inc/RMCF1210FT10K0/1758528; Composition: Thick Film; Device Package: 1210 (3225 Metric); Features: Automotive AEC-Q200; Height - Seated (Max): 0.028" (0.70mm); Lifecycle Status: Active; Minimum Order: 1; Number of Terminations: 2; Operating Temperature: -55°C ~ 155°C; Package / Case: 1210 (3225 Metric); Packaging: TapeAndReel; Part Status: Active; Price: 0.01; Ratings: AEC-Q200; Resistance: 10 kOhms; Series: RMCF; Size / Dimension: 0.126" L x 0.098" W (3.20mm x 2.50mm); Supplier 1: DigiKey; Supplier Part Number 1: RMCF1210FT10K0CT-ND; Supplier Device Package: 1210; Tolerance: ±1%; Value: 10 kOhms
  R?#22 R?#24 R?#33-R?#36: LastUpdated: 16.01.2024 21:51:52
  R?#23 R?#25 R?#37-R?#40: LastUpdated: 14.01.2024 21:48:20
R?#26-R?#31 = CRGCQ1210F47K: RES 47K OHM 1% 1/2W 1210; Manufacturer: TE Connectivity Passive Product; Power (Watts): 0.5W, 1/2W; Temperature Coefficient: ±100ppm/°C; Part Number: CRGCQ1210F47K; ComponentLink1Description: Datasheet; ComponentLink1URL: https://www.te.com/commerce/DocumentDelivery/DDEController?Action=srchrtrv&DocNm=1773204-3&DocType=DS&DocLang=English; ComponentLink2Description: DigiKey Link; ComponentLink2URL: https://www.digikey.com/en/products/detail/te-connectivity-passive-product/CRGCQ1210F47K/8576493; Composition: Thick Film; Device Package: 1210 (3225 Metric); Features: Automotive AEC-Q200, Moisture Resistant; Height - Seated (Max): 0.026" (0.65mm); LastUpdated: 16.01.2024 21:51:51; Lifecycle Status: Active; Minimum Order: 1; Number of Terminations: 2; Operating Temperature: -55°C ~ 155°C; Package / Case: 1210 (3225 Metric); Packaging: TapeAndReel; Part Status: Active; Price: 0.03; Ratings: AEC-Q200; Resistance: 47 kOhms; Series: CRGCQ; Size / Dimension: 0.122" L x 0.102" W (3.10mm x 2.60mm); Supplier 1: DigiKey; Supplier Part Number 1: A129891CT-ND; Supplier Device Package: 1210; Tolerance: ±1%; Value: 47 kOhms
R?#32 R?#41 R?#42 = RMCF1210FT1K40: as R?#19 on sheet PROTECTION; Part Number: RMCF1210FT1K40; ComponentLink1Description: Datasheet; ComponentLink1URL: https://www.seielect.com/catalog/sei-rmcf_rmcp.pdf; ComponentLink2Description: DigiKey Link; ComponentLink2URL: https://www.digikey.com/en/products/detail/stackpole-electronics-inc/RMCF1210FT1K40/1715350; Composition: Thick Film; Device Package: 1210 (3225 Metric); Features: Automotive AEC-Q200; Height - Seated (Max): 0.028" (0.70mm); LastUpdated: 13.01.2024 21:51:14; Lifecycle Status: Active; Minimum Order: 1; Number of Terminations: 2; Operating Temperature: -55°C ~ 155°C; Package / Case: 1210 (3225 Metric); Packaging: TapeAndReel; Part Status: Active; Price: 0.01; Ratings: AEC-Q200; Series: RMCF; Size / Dimension: 0.126" L x 0.098" W (3.20mm x 2.50mm); Supplier 1: DigiKey; Supplier Part Number 1: 738-RMCF1210FT1K40CT-ND; Supplier Device Package: 1210; Tolerance: ±1%